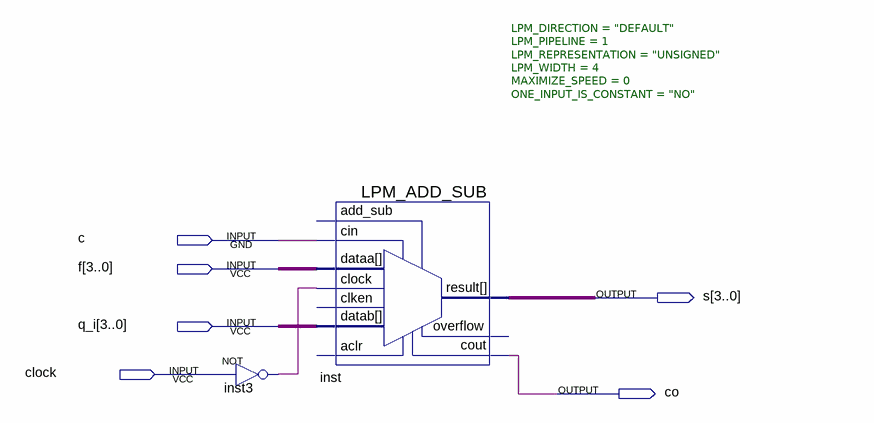
[diagram p0: schematic sheet]
// Quartus schematic sm_2.bdf as structural Verilog: 2 symbols, 6 pins
module sm_2 (
  input  c,
  input  [3:0] f,
  input  [3:0] q_i,
  input  clock,
  output [3:0] s,
  output co
);

  wire inst3_out;

  not inst3 (inst3_out, clock);
  LPM_ADD_SUB #(.LPM_DIRECTION("DEFAULT"), .LPM_PIPELINE(1), .LPM_REPRESENTATION("UNSIGNED"), .LPM_WIDTH(4), .MAXIMIZE_SPEED(0), .ONE_INPUT_IS_CONSTANT("NO")) inst (
    .datab(q_i), .dataa(f), .cin(c), .clock(inst3_out), .cout(co), .result(s));  // open: add_sub, aclr, clken, overflow
endmodule
